# Altium schematic sheet lyaptsev_control_board_2.SchDoc
size 840 x 594 mm
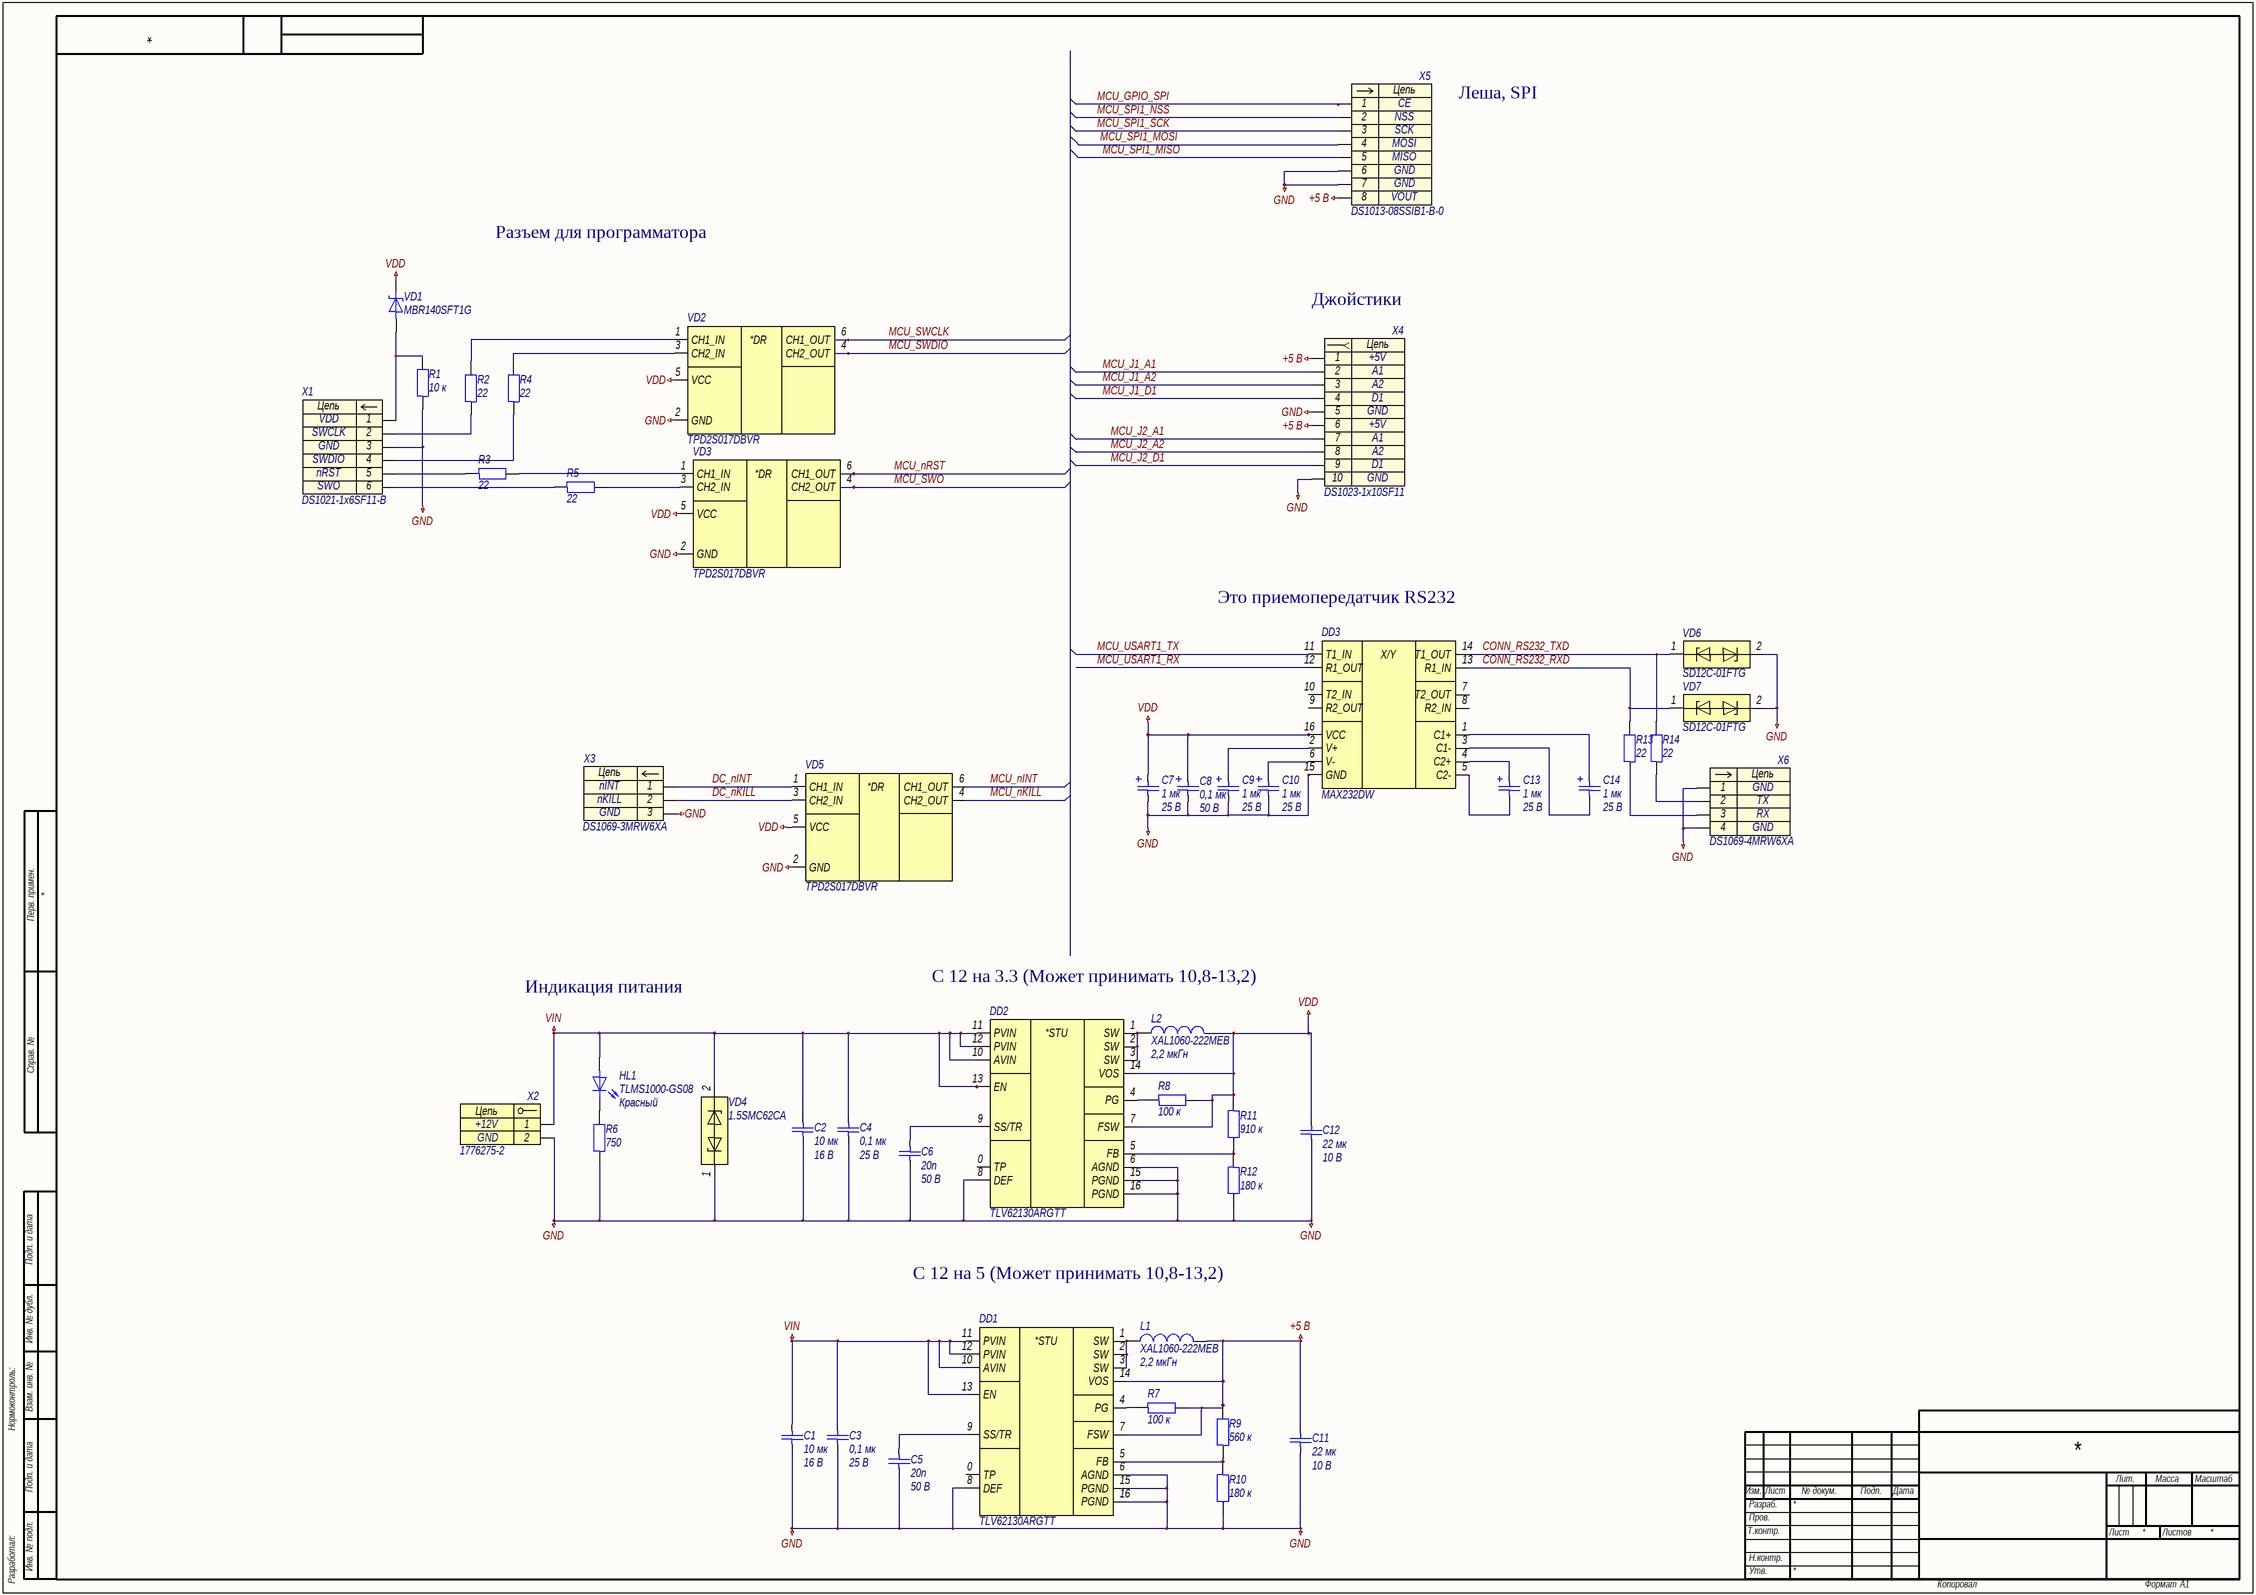
[diagram p0: lyaptsev_control_board_2.SchDoc]

## Parts
C1  10 мк  Напряжение: 16 В  [C0805]
C2  10 мк  Напряжение: 16 В  [C0805]
C3  0,1 мк  Напряжение: 25 В  [C0603]
C4  0,1 мк  Напряжение: 25 В  [C0603]
C5  20п  Напряжение: 50 В  [C0402]
C6  20п  Напряжение: 50 В  [C0402]
C7  1 мк  Напряжение: 25 В  [C3216-18]
C8  0,1 мк  Напряжение: 50 В  [C3216-18]
C9  1 мк  Напряжение: 25 В  [C3216-18]
C10  1 мк  Напряжение: 25 В  [C3216-18]
C11  22 мк  Напряжение: 10 В  [C1206]
C12  22 мк  Напряжение: 10 В  [C1206]
C13  1 мк  Напряжение: 25 В  [C3216-18]
C14  1 мк  Напряжение: 25 В  [C3216-18]
DD1  TLV62130ARGTT  [WQFN-16-P50-300X300X100-L40X24-T168X168]
DD2  TLV62130ARGTT  [WQFN-16-P50-300X300X100-L40X24-T168X168]
DD3  MAX232DW  [SOIC-16-P127-1030X750X265-L84X41]
HL1  TLMS1000-GS08  Цвет: Красный  [HL0603]
L1  XAL1060-222MEB  Индуктивность: 2,2 мкГн  [XAL-2-1130X1000X600]
L2  XAL1060-222MEB  Индуктивность: 2,2 мкГн  [XAL-2-1130X1000X600]
R1  10 к  [R0603]
R2  22  [R0603]
R3  22  [R0603]
R4  22  [R0603]
R5  22  [R0603]
R6  750  [R0603]
R7  100 к  [R0603]
R8  100 к  [R0603]
R9  560 к  [R0603]
R10  180 к  [R0603]
R11  910 к  [R0603]
R12  180 к  [R0603]
R13  22  [R0603]
R14  22  [R0603]
VD1  MBR140SFT1G  [SOD-123FL-370X165X98]
VD2  TPD2S017DBVR  [SOT-23-6-P95-290X280X145]
VD3  TPD2S017DBVR  [SOT-23-6-P95-290X280X145]
VD4  1.5SMC62CA  [DO-214AB-790X590X262]
VD5  TPD2S017DBVR  [SOT-23-6-P95-290X280X145]
VD6  SD12C-01FTG  [SOD-323-257X130X114]
VD7  SD12C-01FTG  [SOD-323-257X130X114]
X1  DS1021-1x6SF11-B  [DS1021-1X6SF11-B]
X2  1776275-2  [1776275-2]
X3  DS1069-3MRW6XA  [DS1069-3MRW6XA]
X4  DS1023-1x10SF11  [DS1023-1X10SF11]
X5  DS1013-08SSIB1-B-0  [DS1013-08SSiB1-B-0]
X6  DS1069-4MRW6XA  [DS1069-4MRW6XA]

## Nets
+5 В: C11.1 DD1.7(FSW) DD1.14(VOS) L1.2 R7.2 R9.2 X4.1 X4.6 X5.8
GND: C1.2 C2.2 C3.2 C4.2 C5.1 C6.1 C7.2 C8.2 C9.2 C10.2 C11.2 C12.2 DD1.6(AGND) DD1.8(DEF) DD1.15(PGND) DD1.16(PGND) DD2.6(AGND) DD2.8(DEF) DD2.15(PGND) DD2.16(PGND) DD3.15(GND) R1.1 R6.1 R10.2 R12.2 VD2.2(GND) VD3.2(GND) VD4.1 VD5.2(GND) VD6.2 VD7.2 X1.3 X2.2 X3.3 X4.5 X4.10 X5.6 X5.7 X6.1 X6.4
VDD: C7.1 C8.1 C12.1 DD2.7(FSW) DD2.14(VOS) DD3.16(VCC) L2.2 R8.2 R11.1 VD1.1 VD2.5(VCC) VD3.5(VCC) VD5.5(VCC)
VIN: C1.1 C2.1 C3.1 C4.1 DD1.10(AVIN) DD1.11(PVIN) DD1.12(PVIN) DD1.13(EN) DD2.10(AVIN) DD2.11(PVIN) DD2.12(PVIN) DD2.13(EN) HL1.2 VD4.2 X2.1
CONN_RS232_RXD: DD3.13(R1_IN) R13.2 VD7.1
CONN_RS232_TXD: DD3.14(T1_OUT) R14.2 VD6.1
DC_nINT: VD5.1(CH1_IN) X3.1
DC_nKILL: VD5.3(CH2_IN) X3.2
MCU_GPIO_SPI: X5.1
MCU_J1_A1: X4.2
MCU_J1_A2: X4.3
MCU_J1_D1: X4.4
MCU_J2_A1: X4.7
MCU_J2_A2: X4.8
MCU_J2_D1: X4.9
MCU_nINT: VD5.6(CH1_OUT)
MCU_nKILL: VD5.4(CH2_OUT)
MCU_nRST: VD3.6(CH1_OUT)
MCU_SPI1_MISO: X5.5
MCU_SPI1_MOSI: X5.4
MCU_SPI1_NSS: X5.2
MCU_SPI1_SCK: X5.3
MCU_SWCLK: VD2.6(CH1_OUT)
MCU_SWDIO: VD2.4(CH2_OUT)
MCU_SWO: VD3.4(CH2_OUT)
MCU_USART1_RX: DD3.12(R1_OUT)
MCU_USART1_TX: DD3.11(T1_IN)
NetC5_2: C5.2 DD1.9(SS/TR)
NetC6_2: C6.2 DD2.9(SS/TR)
NetC9_1: C9.1 DD3.2(V+)
NetC10_1: C10.1 DD3.6(V-)
NetC13_1: C13.1 DD3.4(C2+)
NetC13_2: C13.2 DD3.5(C2-)
NetC14_1: C14.1 DD3.1(C1+)
NetC14_2: C14.2 DD3.3(C1-)
NetDD1_1: DD1.1(SW) DD1.2(SW) DD1.3(SW) L1.1
NetDD1_4: DD1.4(PG) R7.1
NetDD1_5: DD1.5(FB) R9.1 R10.1
NetDD2_1: DD2.1(SW) DD2.2(SW) DD2.3(SW) L2.1
NetDD2_4: DD2.4(PG) R8.1
NetDD2_5: DD2.5(FB) R11.2 R12.1
NetHL1_1: HL1.1 R6.2
NetR1_2: R1.2 VD1.2 X1.1
NetR2_1: R2.1 X1.2
NetR2_2: R2.2 VD2.1(CH1_IN)
NetR3_1: R3.1 X1.5
NetR3_2: R3.2 VD3.1(CH1_IN)
NetR4_1: R4.1 X1.4
NetR4_2: R4.2 VD2.3(CH2_IN)
NetR5_1: R5.1 X1.6
NetR5_2: R5.2 VD3.3(CH2_IN)
NetR13_1: R13.1 X6.3
NetR14_1: R14.1 X6.2

Not connected (* = marked no-connect by the designer): DD1 0(TP); DD2 0(TP); DD3 7(T2_OUT) 8(R2_IN) 9(R2_OUT) 10(T2_IN)

## Notes on the sheet
- Леша, SPI
- Разъем для программатора
- Джойстики
- Это приемопередатчик RS232
- С 12 на 3.3 (Может принимать 10,8-13,2)
- Индикация питания
- С 12 на 5 (Может принимать 10,8-13,2)
- Перв. примен.
- Справ. №
- Подп. и дата
- Инв. № дубл.
- Нормоконтроль:
- Взам. инв. №
- Изм.
- Лист
- № докум.
- Подп.
- Дата
- Лит.
- Масса
- Масштаб
- Т.контр.
- Пров.
- Разраб.
- Листов
- Разработал:
- Инв. № подл.
- Н.контр.
- Утв.
- Копировал
- Формат
- А1
- (in symbol dd0014) X/Y
- (in symbol dd0019) *STU
- (in symbol vd0016) *DR
- (in symbol x0008) Цепь
- (in symbol x0026) Цепь
- (in symbol x0034) Цепь
- (in symbol x0035) Цепь
- (in symbol x0039) Цепь
- (in symbol x0041) Цепь

## Library data of the parts
C1 C2 = c0126: =Описание; ID: c0126; Фамилия: Паньков; Описание: Конденсатор керамический чип 0805 10 мкФ 16 В ±10 %; Наименование: CC0805KKX7R7BB106; Производитель: YAGEO Corp.; Отклонение: ±10 %; Рабочие температуры: от –55 °С до +125 °С; Температурный коэффициент емкости: X7R; Корпус: 0805; Номинал: 10 мк; Номинальное напряжение: 16 В; HelpURL: https://www.yageo.com/upload/media/product/productsearch/datasheet/mlcc/UPY-GPHC_X7R_6.3V-to-50V_20.pdf
C3 C4 = c0063: =Описание; ID: c0063; Фамилия: Паньков; Описание: Конденсатор керамический чип 0603 100 нФ 25 В ±10 %; Наименование: CC0603KRX7R8BB104; Производитель: YAGEO Corp.; Отклонение: ±10 %; Рабочие температуры: от –55 °С до +125 °С; Температурный коэффициент емкости: X7R; Корпус: 0603; Номинал: 0,1 мк; Номинальное напряжение: 25 В; HelpURL: https://www.yageo.com/upload/media/product/productsearch/datasheet/mlcc/UPY-GPHC_X7R_6.3V-to-50V_20.pdf
C5 C6 = с0038: =Описание; ID: с0038; Фамилия: Ляпцев; Описание: Конденсатор чип 0402 20 пФ 25 В ±5 %; Наименование: CC0402JRNPO9BN200; Производитель: YAGEO Corp.; Отклонение: ±5 %; Рабочие температуры: от -55 °С до +85 °С; Корпус: 0402; Номинал: 20п; Номинальное напряжение: 50 В; HelpURL: https://www.yageo.com/upload/media/product/productsearch/datasheet/mlcc/UPY-GP_NP0_16V-to-50V_18.pdf
C7 C9 C10 C13 C14 = c0014: =Описание; ID: c0014; Фамилия: Ларионов; Описание: Конденсатор танталовый чип 3216-18 1 мкФ 25 В ±10 %; Наименование: 293D105X9025A2TE3; Производитель: Vishay Intertechnology, Inc.; Отклонение: ±10 %; Эквивалентное последовательное сопротивление: 7,6 Ом; Среднеквадратичный размах пульсации тока: 0,10 А; Рабочие температуры: от –55 °С до +125 °С; Корпус: 3216-18; Номинал: 1 мк; Номинальное напряжение: 25 В; HelpURL: https://www.vishay.com/capacitors/list/product-40002/
C8 = c0001: =Описание; ID: c0001; Фамилия: Ларионов; Описание: Конденсатор танталовый чип 3216-18 100 нФ 50 В ±10 %; Наименование: 293D104X9050A2TE3; Производитель: Vishay Intertechnology, Inc.; Отклонение: ±10 %; Эквивалентное последовательное сопротивление: 19,0 Ом; Среднеквадратичный размах пульсации тока: 0,06 А; Рабочие температуры: от –55 °С до +125 °С; Корпус: 3216-18; Номинал: 0,1 мк; Номинальное напряжение: 50 В; HelpURL: https://www.vishay.com/capacitors/list/product-40002/
C11 C12 = c0137: =Описание; ID: c0137; Фамилия: Паньков; Описание: Конденсатор керамический чип 1206 22 мкФ 10 В ±10 %; Наименование: CC1206KKX5R6BB226; Производитель: YAGEO Corp.; Отклонение: ±10 %; Рабочие температуры: от –55 °С до +85 °С; Температурный коэффициент емкости: X5R; Корпус: 1206; Номинал: 22 мк; Номинальное напряжение: 10 В; HelpURL: https://www.yageo.com/upload/media/product/productsearch/datasheet/mlcc/UPY-GPHC_X5R_4V-to-50V_26.pdf
DD1 DD2 = dd0019: =Описание; ID: dd0019; Фамилия: Самарин; Описание: Понижающий преобразователь напряжения 17 В и 3 А; Производитель: Texas Instruments Inc.; Входное напряжение: от 3 В до 17 В; Выходное напряжение: от 0,9 до 5,25 В; Коммутируемый ток: до 3 А; Частота переключения: от 1,25 МГц до 2,5 МГц; Рабочие температуры: от –40 °С до +85 °С; Корпус: WQFN-16; Наименование: TLV62130ARGTT; HelpURL: https://www.ti.com/product/TLV62130
DD3 = dd0014: =Описание; ID: dd0014; Фамилия: Паньков; Описание: Приемопередатчик RS-232; Производитель: Texas Instruments Inc.; Рабочие температуры: от 0 до +70 °C; Корпус: SOIC-16; Наименование: MAX232DW; HelpURL: https://www.ti.com/product/MAX232
HL1 = hl0001: =Описание; ID: hl0001; Фамилия: Ларионов; Описание: Светодиод чип 0603 красный; Производитель: Vishay Intertechnology, Inc.; Номинальная сила света: 4 мкд; Номинальная длина волны: 628 нм; Номинальный прямой ток: 15 мА; Номинальное падение напряжения: 1,8 В; Рассеиваемая мощность: 40 мВт; Рабочие температуры: от –40 °С до +100 °С; Корпус: 0603; Наименование: TLMS1000-GS08; HelpURL: https://www.vishay.com/leds/list/product-83172/
L1 L2 = l0002: =Описание; ID: l0002; Фамилия: Ларионов; Описание: Катушка индуктивности 2,2 мкГн ±20 %; Производитель: Coilcraft, Inc.; Отклонение: ±20 %; Номинальное активное сопротивление: 4,5 мОм; Максимальное активное сопротивление: 4,95 мОм; Резонансная частота: 25 МГц; Номинальный ток (при нагреве на 20 °С/40 °С): 13,9 А; Ток насыщения: 32 А; Рабочее напряжение: от 0 В до 60 В; Рабочие температуры: от –40 °С до +125 °С; Корпус: 11,3 x 10,0 x 6,0; Наименование: XAL1060-222MEB; Номинал: 2,2 мкГн; HelpURL: https://www.coilcraft.com/en-us/products/power/shielded-inductors/molded-inductor/xal/xal1060/
R1 = r0105: =Описание; ID: r0105; Фамилия: Самарин; Описание: Резистор чип 0603 10 кОм ±1 % 0,1 Вт; Наименование: RC0603FR-0710KL; Производитель: YAGEO Corp.; Отклонение: ±1 %; Номинальное напряжение: 75 В; Номинальный ток: 1 А; Рабочие температуры: от –55 °С до +155 °С; Корпус: 0603; Примечание: Ряд E24; Номинал: 10 к; HelpURL: https://www.yageo.com/upload/media/product/productsearch/datasheet/rchip/PYu-RC_Group_51_RoHS_L_11.pdf
R2-R5 = r0034: =Описание; ID: r0034; Фамилия: Ларионов; Описание: Резистор чип 0603 22 Ом ±1 % 0,1 Вт; Наименование: RC0603FR-0722RL; Производитель: YAGEO Corp.; Отклонение: ±1 %; Номинальное напряжение: 75 В; Номинальный ток: 1 А; Рабочие температуры: от –55 °С до +155 °С; Корпус: 0603; Примечание: Ряд E24; Номинал: 22; HelpURL: https://www.yageo.com/upload/media/product/productsearch/datasheet/rchip/PYu-RC_Group_51_RoHS_L_11.pdf
R6 = r0028: =Описание; ID: r0028; Фамилия: Паньков; Описание: Резистор чип 0603 750 Ом ±1 % 0,1 Вт; Наименование: RC0603FR-07750RL; Производитель: YAGEO Corp.; Отклонение: ±1 %; Номинальное напряжение: 75 В; Номинальный ток: 1 А; Рабочие температуры: от –55 °С до +155 °С; Корпус: 0603; Примечание: Ряд E24; Номинал: 750; HelpURL: https://www.yageo.com/upload/media/product/productsearch/datasheet/rchip/PYu-RC_Group_51_RoHS_L_11.pdf
R7 R8 = r0141: =Описание; ID: r0141; Фамилия: Водорезов; Описание: Резистор чип 0603 100 кОм ±1 % 0,1 Вт; Наименование: RC0603FR-07100KL; Производитель: YAGEO Corp.; Отклонение: ±1 %; Номинальное напряжение: 75 В; Номинальный ток: 1 А; Рабочие температуры: от –55 °С до +155 °С; Корпус: 0603; Примечание: Ряд E24; Номинал: 100 к; HelpURL: https://www.yageo.com/upload/media/product/productsearch/datasheet/rchip/PYu-RC_Group_51_RoHS_L_11.pdf
R9 = r0167: =Описание; ID: r0167; Фамилия: Паньков; Описание: Резистор чип 0603 560 кОм ±1 % 0,1 Вт; Наименование: RC0603FR-07560KL; Производитель: YAGEO Corp.; Отклонение: ±1 %; Номинальное напряжение: 75 В; Номинальный ток: 1 А; Рабочие температуры: от –55 °С до +155 °С; Корпус: 0603; Примечание: Ряд E24; Номинал: 560 к; HelpURL: https://www.yageo.com/upload/media/product/productsearch/datasheet/rchip/PYu-RC_Group_51_RoHS_L_11.pdf
R10 R12 = r0152: =Описание; ID: r0152; Фамилия: Паньков; Описание: Резистор чип 0603 180 кОм ±1 % 0,1 Вт; Наименование: RC0603FR-07180KL; Производитель: YAGEO Corp.; Отклонение: ±1 %; Номинальное напряжение: 75 В; Номинальный ток: 1 А; Рабочие температуры: от –55 °С до +155 °С; Корпус: 0603; Примечание: Ряд E24; Номинал: 180 к; HelpURL: https://www.yageo.com/upload/media/product/productsearch/datasheet/rchip/PYu-RC_Group_51_RoHS_L_11.pdf
R11 = r0172: =Описание; ID: r0172; Фамилия: Паньков; Описание: Резистор чип 0603 910 кОм ±1 % 0,1 Вт; Наименование: RC0603FR-07910KL; Производитель: YAGEO Corp.; Отклонение: ±1 %; Номинальное напряжение: 75 В; Номинальный ток: 1 А; Рабочие температуры: от –55 °С до +155 °С; Корпус: 0603; Примечание: Ряд E24; Номинал: 910 к; HelpURL: https://www.yageo.com/upload/media/product/productsearch/datasheet/rchip/PYu-RC_Group_51_RoHS_L_11.pdf
R13 R14 = r0004: =Описание; ID: r0004; Фамилия: Ларионов; Описание: Резистор чип 0603 22 Ом ±1 % 0,1 Вт; Наименование: RC0603FR-0722RL; Производитель: YAGEO Corp.; Отклонение: ±1 %; Номинальное напряжение: 75 В; Номинальный ток: 1 А; Рабочие температуры: от –55 °С до +155 °С; Корпус: 0603; Примечание: Ряд E24; Номинал: 22; HelpURL: https://www.yageo.com/upload/media/product/productsearch/datasheet/rchip/PYu-RC_Group_51_RoHS_L_11.pdf
VD1 = vd0002: =Описание; ID: vd0002; Фамилия: Паньков; Описание: Диод Шоттки 40 В 1 А; Производитель: ON Semiconductor; Максимальное прямое напряжение: 0,88 В; Максимальное обратное напряжение: 40 В; Максимальный прямой ток: 1 А; Рабочие температуры: от –55 °С до +125 °С; Корпус: SOD-123FL; Наименование: MBR140SFT1G; HelpURL: https://www.onsemi.com/products/discretes-drivers/diodes-rectifiers/schottky-diodes-schottky-rectifiers/mbr140sf
VD2 VD3 VD5 = vd0016: =Описание; ID: vd0016; Фамилия: Паньков; Описание: Диодная сборка для подавления помех 5 В; Производитель: Texas Instruments Inc.; Корпус: SOT-23-6; Наименование: TPD2S017DBVR; HelpURL: https://www.ti.com/product/TPD2S017
VD4 = vd0009: =Описание; ID: vd0009; Фамилия: Ларионов; Описание: Двунаправленная диодная сборка для подавления помех 53 В; Производитель: Littelfuse, Inc.; Корпус: DO-214AB; Наименование: 1.5SMC62CA; HelpURL: https://www.littelfuse.com/products/tvs-diodes/surface-mount/1_5smc.aspx
VD6 VD7 = vd0004: =Описание; ID: vd0004; Фамилия: Ларионов; Описание: Двунаправленная диодная сборка для подавления помех 12 В; Производитель: Littelfuse, Inc.; Корпус: SOD-323; Наименование: SD12C-01FTG; HelpURL: https://www.littelfuse.com/products/tvs-diode-arrays/general-purpose-esd-protection/sdc/sd12c_01ftg.aspx
X1 = x0026: =Описание; Contact_1: VDD; Contact_2: SWCLK; Contact_3: GND; Contact_4: SWDIO; Contact_5: nRST; Contact_6: SWO; ID: x0026; Фамилия: Паньков; Описание: PLS 6 pin 2,54 мм вилка прямой; Производитель: Connfly Electronic Co., Ltd.; Наименование: DS1021-1x6SF11-B; HelpURL: http://en.connfly.group/product/xVkr=EusQssAN0gN=Aos=mU+UrVkR9kqEAN0gN9g+WqANB+A
X2 = x0008: =Описание; Contact_1: +12V; Contact_2: GND; ID: x0008; Фамилия: Паньков; Описание: Terminal Block 2 pin 3,5 мм; Производитель: TE Connectivity; Наименование: 1776275-2; HelpURL: https://www.te.com/usa-en/product-1776275-2.html
X3 = x0039: =Описание; Contact_1: nINT; Contact_2: nKILL; Contact_3: GND; ID: x0039; Фамилия: Паньков; Описание: CWF 3 pin Type A 2,5 мм вилка угловой; Производитель: Connfly Electronic Co., Ltd.; Наименование: DS1069-3MRW6XA; HelpURL: http://en.connfly.group/product/xVkr=EusQssAN0gN=Aos=mU+UrVkR9kqEAN0gN0MUR+g+NB+A
X4 = x0035: =Описание; Contact_1: +5V; Contact_2: A1; Contact_3: A2; Contact_4: D1; Contact_5: GND; ID: x0035; Фамилия: Паньков; Описание: PBS 10 pin 2,54 мм гнездо прямой; Производитель: Connfly Electronic Co., Ltd.; Contact_6: +5V; Contact_7: A1; Contact_8: A2; Contact_9: D1; Contact_10: GND; Наименование: DS1023-1x10SF11; HelpURL: http://en.connfly.group/product/xVkr=EusQssAN0gN=Aos=mU+UrVkR9kqEAN0gN0AUCUNB+A
X5 = x0034: =Описание; Contact_1: CE; Contact_2: NSS; Contact_3: SCK; Contact_4: MOSI; Contact_5: MISO; Contact_6: GND; Contact_8: VOUT; ID: x0034; Фамилия: Самарин; Описание: Box Header 8 pin 2,54 мм вилка прямой; Производитель: Connfly Electronic Co., Ltd.; Contact_7: GND; Наименование: DS1013-08SSIB1-B-0; HelpURL: http://en.connfly.group/product/xVkr=EusQssAN0gN=Aos=mU+UrVkR9kqEAN0gN9g+Upc+NB+A
X6 = x0041: =Описание; Contact_1: GND; Contact_2: TX; Contact_3: RX; ID: x0041; Фамилия: Паньков; Описание: CWF 4 pin Type A 2,5 мм вилка угловой; Производитель: Connfly Electronic Co., Ltd.; Contact_4: GND; Наименование: DS1069-4MRW6XA; HelpURL: http://en.connfly.group/product/xVkr=EusQssAN0gN=Aos=mU+UrVkR9kqEAN0gN0MUR+g+NB+A